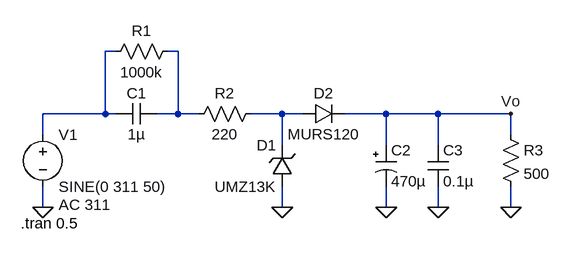
[diagram p0: schematic Transformerless.asc]
Transformerless.asc, the LTspice schematic file:
Version 4
SHEET 1 880 680
WIRE 0 16 -16 16
WIRE 96 16 80 16
WIRE -16 112 -16 16
WIRE -16 112 -112 112
WIRE 0 112 -16 112
WIRE 96 112 96 16
WIRE 96 112 64 112
WIRE 128 112 96 112
WIRE 256 112 208 112
WIRE 288 112 256 112
WIRE 416 112 352 112
WIRE 496 112 416 112
WIRE 608 112 496 112
WIRE -112 144 -112 112
WIRE 608 144 608 112
WIRE 256 160 256 112
WIRE 416 160 416 112
WIRE 496 160 496 112
WIRE -112 256 -112 224
WIRE 256 256 256 224
WIRE 416 256 416 224
WIRE 496 256 496 224
WIRE 608 256 608 224
FLAG -112 256 0
FLAG 256 256 0
FLAG 416 256 0
FLAG 496 256 0
FLAG 608 256 0
FLAG 608 112 Vo
SYMBOL voltage -112 128 R0
WINDOW 123 24 124 Left 2
WINDOW 39 0 0 Left 0
SYMATTR InstName V1
SYMATTR Value SINE(0 311 50)
SYMATTR Value2 AC 311
SYMBOL res 96 0 R90
WINDOW 0 0 56 VBottom 2
WINDOW 3 32 56 VTop 2
SYMATTR InstName R1
SYMATTR Value 1000k
SYMBOL res 224 96 R90
WINDOW 0 0 56 VBottom 2
WINDOW 3 32 56 VTop 2
SYMATTR InstName R2
SYMATTR Value 220
SYMBOL res 592 128 R0
SYMATTR InstName R3
SYMATTR Value 500
SYMBOL cap 64 96 R90
WINDOW 0 0 32 VBottom 2
WINDOW 3 32 32 VTop 2
SYMATTR InstName C1
SYMATTR Value 1µ
SYMBOL polcap 400 160 R0
WINDOW 3 24 56 Left 2
SYMATTR InstName C2
SYMATTR Value 470µ
SYMATTR Description Capacitor
SYMATTR Type cap
SYMATTR SpiceLine V=16 Irms=395m Rser=0.2 Lser=0 mfg="Nichicon" pn="UPR1C471MPH" type="Al electrolytic"
SYMBOL cap 480 160 R0
SYMATTR InstName C3
SYMATTR Value 0.1µ
SYMATTR SpiceLine V=16 Irms=3.85 Rser=0.0464862 Lser=0 mfg="KEMET" pn="C0402C104K4PAC" type="X5R"
SYMBOL zener 272 224 R180
WINDOW 0 24 64 Left 2
WINDOW 3 24 0 Left 2
SYMATTR InstName D1
SYMATTR Value UMZ13K
SYMATTR Description Diode
SYMATTR Type diode
SYMBOL diode 288 128 R270
WINDOW 0 32 32 VTop 2
WINDOW 3 0 32 VBottom 2
SYMATTR InstName D2
SYMATTR Value MURS120
TEXT -146 280 Left 2 !.tran 0.5

The netlist it stands for:
* Transformerless.asc
V1 N001 0 SINE(0 311 50) AC 311
R1 N002 N001 1000k
R2 N003 N002 220
R3 Vo 0 500
C1 N002 N001 1µ
C2 Vo 0 470µ V=16 Irms=395m Rser=0.2 Lser=0 mfg="Nichicon" pn="UPR1C471MPH" type="Al electrolytic"
C3 Vo 0 0.1µ V=16 Irms=3.85 Rser=0.0464862 Lser=0 mfg="KEMET" pn="C0402C104K4PAC" type="X5R"
D1 0 N003 UMZ13K
D2 N003 Vo MURS120
.model D D
.lib standard.dio
.tran 0.5
.backanno
.end